# EAGLE design LiFePo4 (EAGLE 7.7.0)
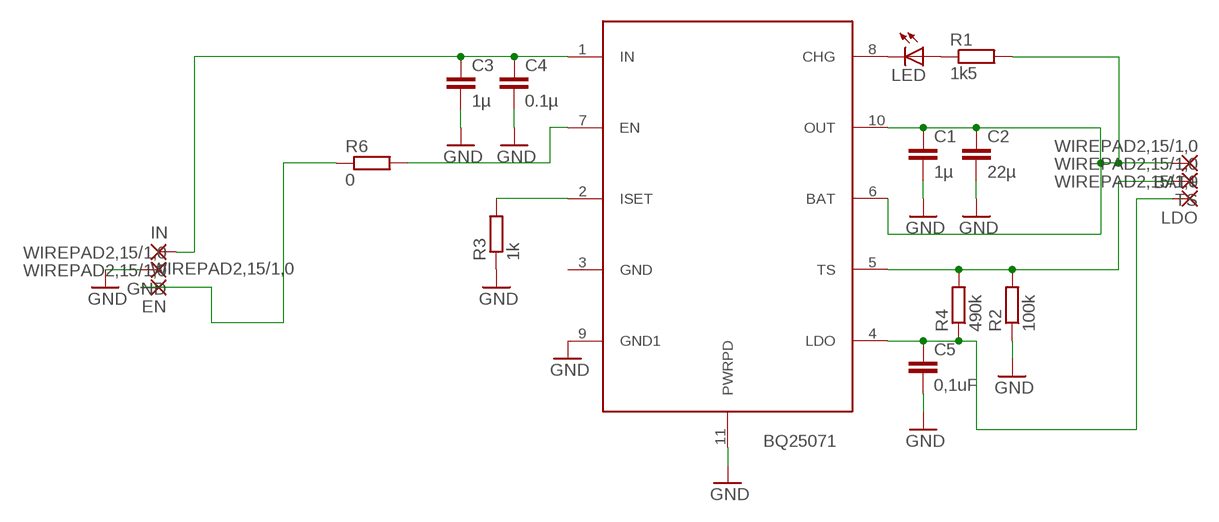
[diagram p0: schematic, sheet 1]

## Parts
BAT+  WIREPAD2,15/1,0  [2,15/1,0]
BQ25071  BQ25071  [WSON-10]
C1  1µ  C-EUC1206  [C1206]
C2  22µ  C-EUC1206  [C1206]
C3  1µ  C-EUC1206  [C1206]
C4  0.1µ  C-EUC1206  [C1206]
C5  0,1uF  C-EUC1206  [C1206]
EN  WIREPAD2,15/1,0  [2,15/1,0]
GND  WIREPAD2,15/1,0  [2,15/1,0]
IN  WIREPAD2,15/1,0  [2,15/1,0]
LDO  WIREPAD2,15/1,0  [2,15/1,0]
LED  LEDSMT1206  [1206]
R1  1k5  R-EU_R1206  [R1206]
R2  100k  R-EU_R1206  [R1206]
R3  1k  R-EU_R1206  [R1206]
R4  490k  R-EU_R1206  [R1206]
R6  0  R-EU_R1206  [R1206]
TS  WIREPAD2,15/1,0  [2,15/1,0]

## Nets
BAT+: BAT+.1(P) BQ25071.6(BAT) BQ25071.10(OUT) C1.1 C2.1 R1.2
CHG: BQ25071.8(CHG) LED.C
GROUND: BQ25071.9(GND1) BQ25071.11(PWRPD) C1.2 C2.2 C3.2 C4.2 C5.2 GND.1(P) R2.1 R3.1 ; supply symbol labelled GND
LDO: BQ25071.4(LDO) C5.1 LDO.1(P) R4.1
N$1: BQ25071.7(EN) R6.2
N$2: LED.A R1.1
N$4: EN.1(P) R6.1
N$5: BQ25071.2(ISET) R3.2
N$7: BQ25071.5(TS) R2.2 R4.2 TS.1(P)
N$9: BQ25071.1(IN) C3.1 C4.1 IN.1(P)

## Power pins joined to a net without a drawn wire
GROUND: BQ25071.3(GND)

## Library data of the parts
BAT+ EN GND IN LDO TS = wirepad:WIREPAD: Wire PAD connect wire on PCB
BQ25071 = texas1:BQ25071: LiFePo4 Battery Charger IC 1A
C1-C5 = rcl:C-EU: CAPACITOR, European symbol
LED = led:LED: LED OSRAM: - CHIPLED LG R971, LG N971, LY N971, LG Q971, LY Q971, LO R971, LY R971 LH N974, LH R974 LS Q976, LO Q976, LY Q976 LO Q996 - Hyper CHIPLED LW Q18S LB Q993, LB Q99A, LB R99A - SideLED LS A670, LO A670, LY A670, LG A670, LP A670 LB A673, LV A673, LT A673, LW A673 LH A674 LY A675 LS A676, LA A676, LO A676, LY A676, LW A676 LS A679, LY A679, LG A679 - Hyper Micro SIDELED® LS Y876, LA Y876, LO Y876, LY Y876 LT Y87S - SmartLED LW L88C, LW L88S LB L89C, LB L89S, LG L890 LS L89K, LO L89K, LY L89K LS L896, LA L896, LO L896, LY L896 - TOPLED LS T670, LO T670, LY T670, LG T670, LP T670 LSG T670, LSP T670, LSY T670, LOP T670, LYG T670 LG T671, LOG T671, LSG T671 LB T673, LV T673, LT T673, LW T673 LH T674 LS T676, LA T676, LO T676, LY T676, LB T676, LH T676, LSB T676, LW T676 LB T67C, LV T67C, LT T67C, LS T67K, LO T67K, LY T67K, LW E67C LS E67B, LA E67B, LO E67B, LY E67B, LB E67C, LV E67C, LT E67C LW T67C LS T679, LY T679, LG T679 LS T770, LO T770, LY T770, LG T770, LP T770 LB T773, LV T773, LT T773, LW T773 LH T774 LS E675, LA E675, LY E675, LS T675 LS T776, LA T776, LO T776, LY T776, LB T776 LHGB T686 LT T68C, LB T68C - Hyper Mini TOPLED® LB M676 - Mini TOPLED Santana® LG M470 LS M47K, LO M47K, LY M47K Source: http://www.osram.convergy.de LUXEON: - LUMILED® LXK2-PW12-R00, LXK2-PW12-S00, LXK2-PW14-U00, LXK2-PW14-V00 LXK2-PM12-R00, LXK2-PM12-S00, LXK2-PM14-U00 LXK2-PE12-Q00, LXK2-PE12-R00, LXK2-PE12-S00, LXK2-PE14-T00, LXK2-PE14-U00 LXK2-PB12-K00, LXK2-PB12-L00, LXK2-PB12-M00, LXK2-PB14-N00, LXK2-PB14-P00, LXK2-PB14-Q00 LXK2-PR12-L00, LXK2-PR12-M00, LXK2-PR14-Q00, LXK2-PR14-R00 LXK2-PD12-Q00, LXK2-PD12-R00, LXK2-PD12-S00 LXK2-PH12-R00, LXK2-PH12-S00 LXK2-PL12-P00, LXK2-PL12-Q00, LXK2-PL12-R00 Source: www.luxeon.com KINGBRIGHT: KA-3528ASYC Source: www.kingbright.com
R1-R4 R6 = rcl:R-EU_: RESISTOR, European symbol

## Board
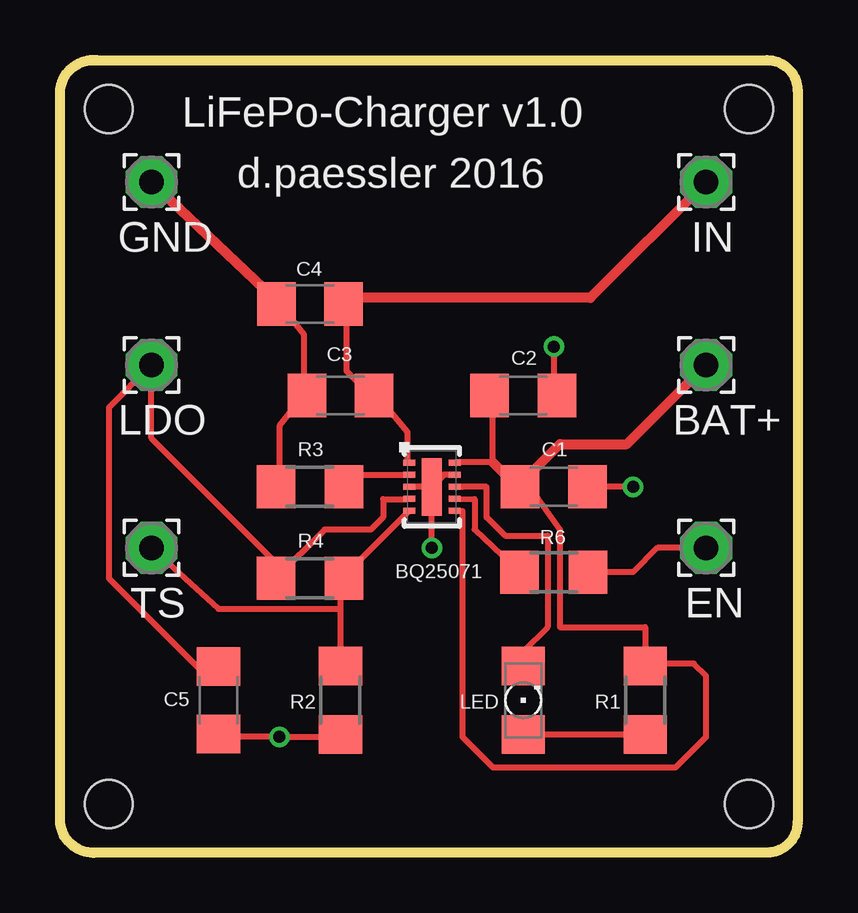
[diagram p1: board, top side]
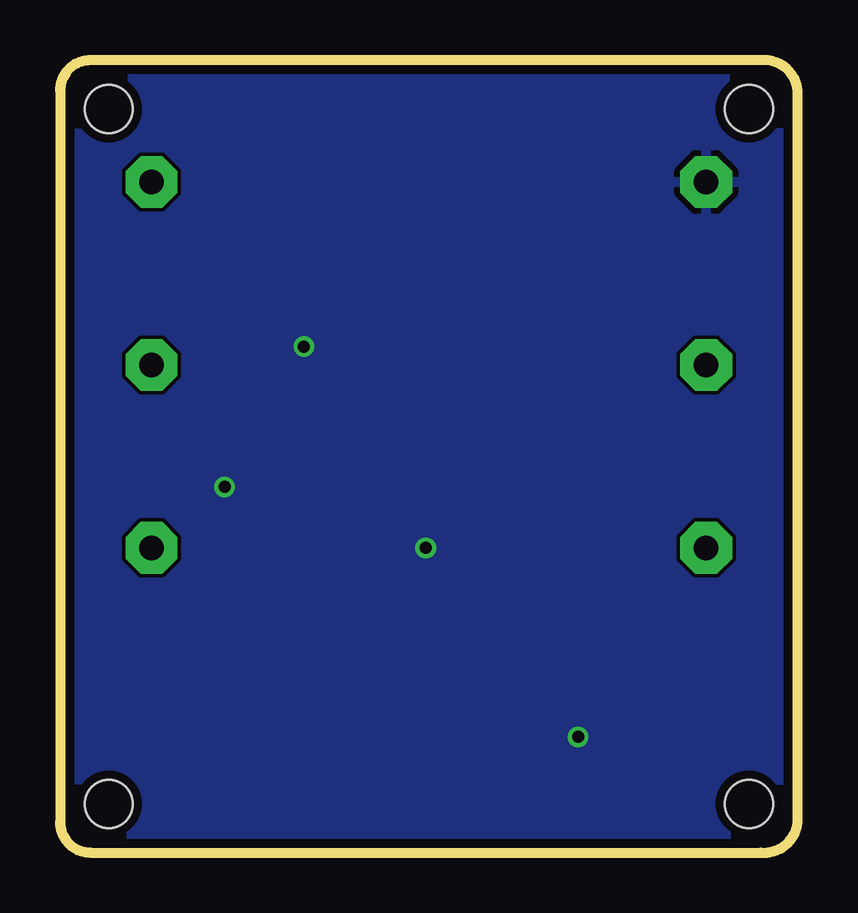
[diagram p2: board, bottom side, seen from below]

Size 30.73 x 33.03 mm. Coordinates in mm from the lower left corner, seen from the top.
Outline: 0,31.76 arc-90 1.52,33.03 29.46,33.03 arc-90 30.73,31.76 30.73,1.28 arc-90 29.46,0.01 1.52,0.01 arc-90 0,1.28 0,31.76
Copper layers (1*16): Top 0.0356mm / dielectric 1.5011mm / Bottom 0.0356mm
Design rules "LaenPCBOrder": minimum track width 6mil, minimum drill 13mil, track to track 6mil, track to pad 6mil, pad to pad 6mil, via to via 6mil, smd to smd 6mil, copper to edge 15mil, drill to drill 6mil, minimum pad ring 7mil, minimum via ring 7mil, stop-mask expansion 3mil, vias tented up to drill 0mil, thermal gap 10mil
Holes 2 mm at 28.7,30.99 28.7,2.04 2.03,2.04 2.03,30.99

### Footprints (pad centres in the part's own frame; a part is rotated, then mirrored left to right if it is on the bottom)
2,15/1,0 = drill 1.016 pad 2.159 octagon: 1 0,0
WSON-10 = smd 0.5 x 0.25: 1 -0.95,1; 2 -0.95,0.5; 3 -0.95,0; 4 -0.95,-0.5; 5 -0.95,-1; 6 0.95,-1; 7 0.95,-0.5; 8 0.95,0; 9 0.95,0.5; 10 0.95,1 | smd 0.84 x 2.4: 11 0,0
C1206 = smd 1.6 x 1.8: 1 -1.4,0; 2 1.4,0
1206 = smd 1.6 x 1.803: A -1.422,0; C 1.422,0
R1206 = smd 1.6 x 1.803: 1 -1.422,0; 2 1.422,0

### Placement (x,y rotation side)
BAT+  26.92,20.33 0 top
BQ25071  15.49,15.25 0 top
C1  20.57,15.25 0 top
C2  19.3,19.06 0 top
C3  11.68,19.06 180 top
C4  10.41,22.87 180 top
C5  6.6,6.36 270 top
EN  26.92,12.71 0 top
GND  3.81,27.95 0 top
IN  26.92,27.95 0 top
LDO  3.81,20.33 0 top
LED  19.3,6.36 90 top
R1  24.38,6.36 90 top
R2  11.68,6.36 90 top
R3  10.41,15.25 0 top
R4  10.41,11.44 0 top
R6  20.57,11.69 180 top
TS  3.81,12.71 0 top

### Tracks (layer width: path | path; a pad name or v marks a point on that pad's centre or on a via)
BAT+
  Top 0.254: BQ25071.10 16.51,16.26 18.03,16.26 18.03,19.06 C2.1 | 19.05,15.25 C1.1 | 19.56,15.25 19.3,15.25 | 19.3,15.25 C1.1 | 19.56,15.25 20.83,13.47 20.83,9.4 24.38,9.4 24.38,7.88 | 19.56,15.25 19.3,15.25 | 19.3,15.25 C1.1 | 16.51,14.23 BQ25071.6 16.76,14.23 16.76,4.83 18.03,3.56 25.65,3.56 26.92,4.83 26.92,7.37 26.42,7.88 24.38,7.88 | 24.38,7.88 R1.2 24.38,7.88
  Top 0.406: 19.56,15.25 19.56,15.75 20.83,17.02 23.62,17.02 BAT+.1 | 19.05,15.25 18.03,16.26
CHG
  Top 0.254: 16.76,15.25 16.51,15.25 BQ25071.8 17.78,15.25 17.78,13.98 18.54,13.21 20.32,13.21 20.32,9.4 19.3,8.39 LED.C
GROUND  (via drill 0.5)
  Top 0.254: 10.16,19.06 10.16,21.6 9.14,22.87 C4.2 8.89,23.12 | 10.16,19.06 C3.2 10.16,19.06 | 10.16,19.06 9.14,17.79 9.14,15.25 R3.1 | BQ25071.3 14.73,15.25 15.24,15.25 BQ25071.11 | 22.1,15.25 C1.2 v23.88,15.25 | 20.83,19.06 C2.2 20.57,19.31 v20.57,21.09 | 6.6,5.09 C5.2 6.6,4.83 v9.14,4.83 11.68,4.83 R2.1 | BQ25071.9 16,15.75 BQ25071.11 | v15.49,12.71 BQ25071.11
  Top 0.406: GND.1 8.89,23.12
  pour Bottom: 1.52,33.03 29.46,33.03 arc-90 30.73,31.76 30.73,1.28 arc-90 29.46,0.01 1.52,0.01 arc-90 0.25,1.28 0.25,31.76 arc-90
LDO
  Top 0.254: BQ25071.4 14.48,14.74 13.46,14.74 13.46,13.98 12.95,13.47 12.19,13.47 11.02,13.47 R4.1 | 9.14,11.44 R4.1 | C5.1 5.84,7.63 2.03,11.44 2.03,13.98 2.03,18.55 LDO.1 3.81,17.28 8.89,12.2 8.89,11.94 R4.1
N$1
  Top 0.254: BQ25071.7 17.27,14.74 17.27,13.47 R6.2
N$2
  Top 0.254: LED.A R1.1
N$4
  Top 0.254: EN.1 24.89,12.71 23.88,11.69 R6.1
N$5
  Top 0.254: BQ25071.2 14.48,15.75 12.19,15.75 11.94,15.25 R3.2
N$7
  Top 0.254: 11.68,10.17 11.68,11.44 R4.2 11.84,11.54 BQ25071.5 | 11.68,10.17 R2.2 | 11.68,10.17 6.6,10.17 TS.1
N$9
  Top 0.254: BQ25071.1 14.48,16.26 14.48,17.53 13.21,19.06 C3.1 12.95,19.06 11.94,20.07 11.94,22.87 C4.1 11.94,23.12
  Top 0.406: 11.94,23.12 22.1,23.12 IN.1

### Text on the board
tPlace: LiFePo-Charger v1.0 | d.paessler 2016